# Altium schematic sheet RK3399PRO-JD4.SchDoc
size A2; SheetNumber: 7; SheetTotal: 16
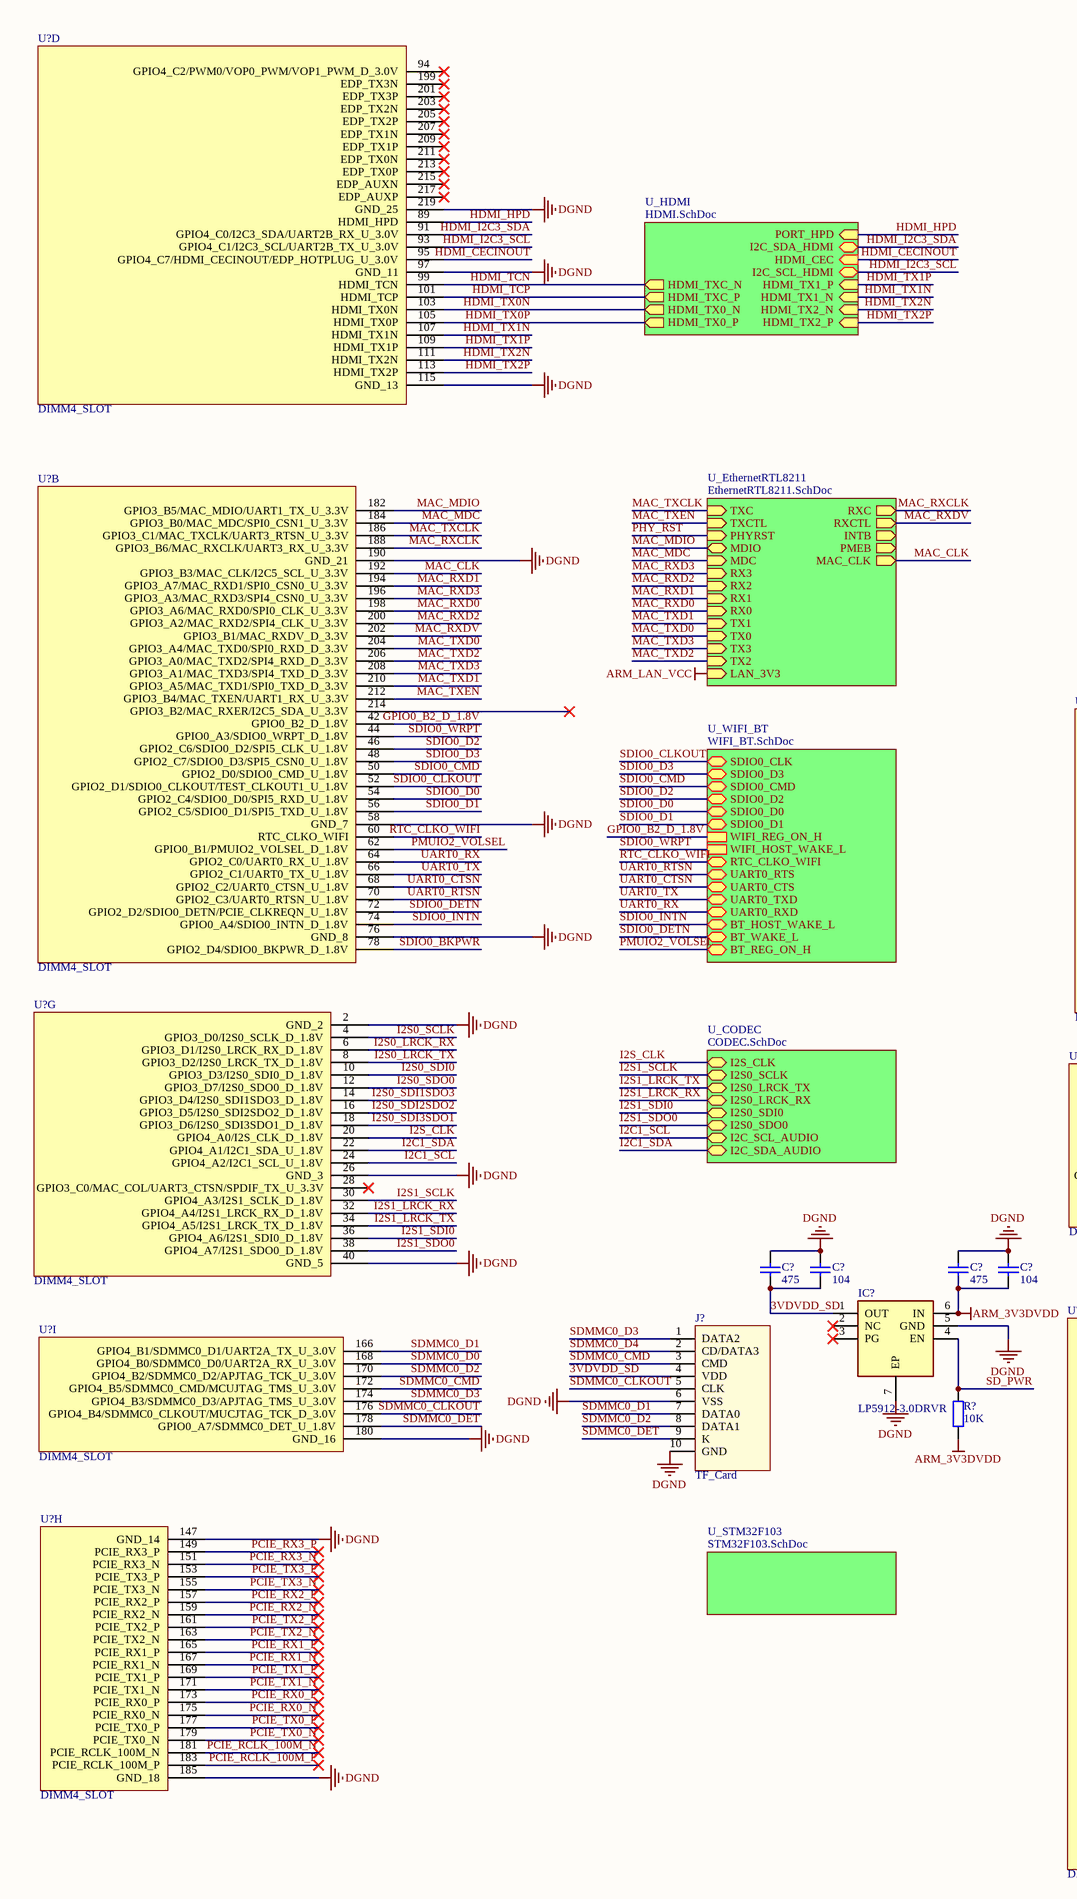
[diagram p0: RK3399PRO-JD4.SchDoc, left]
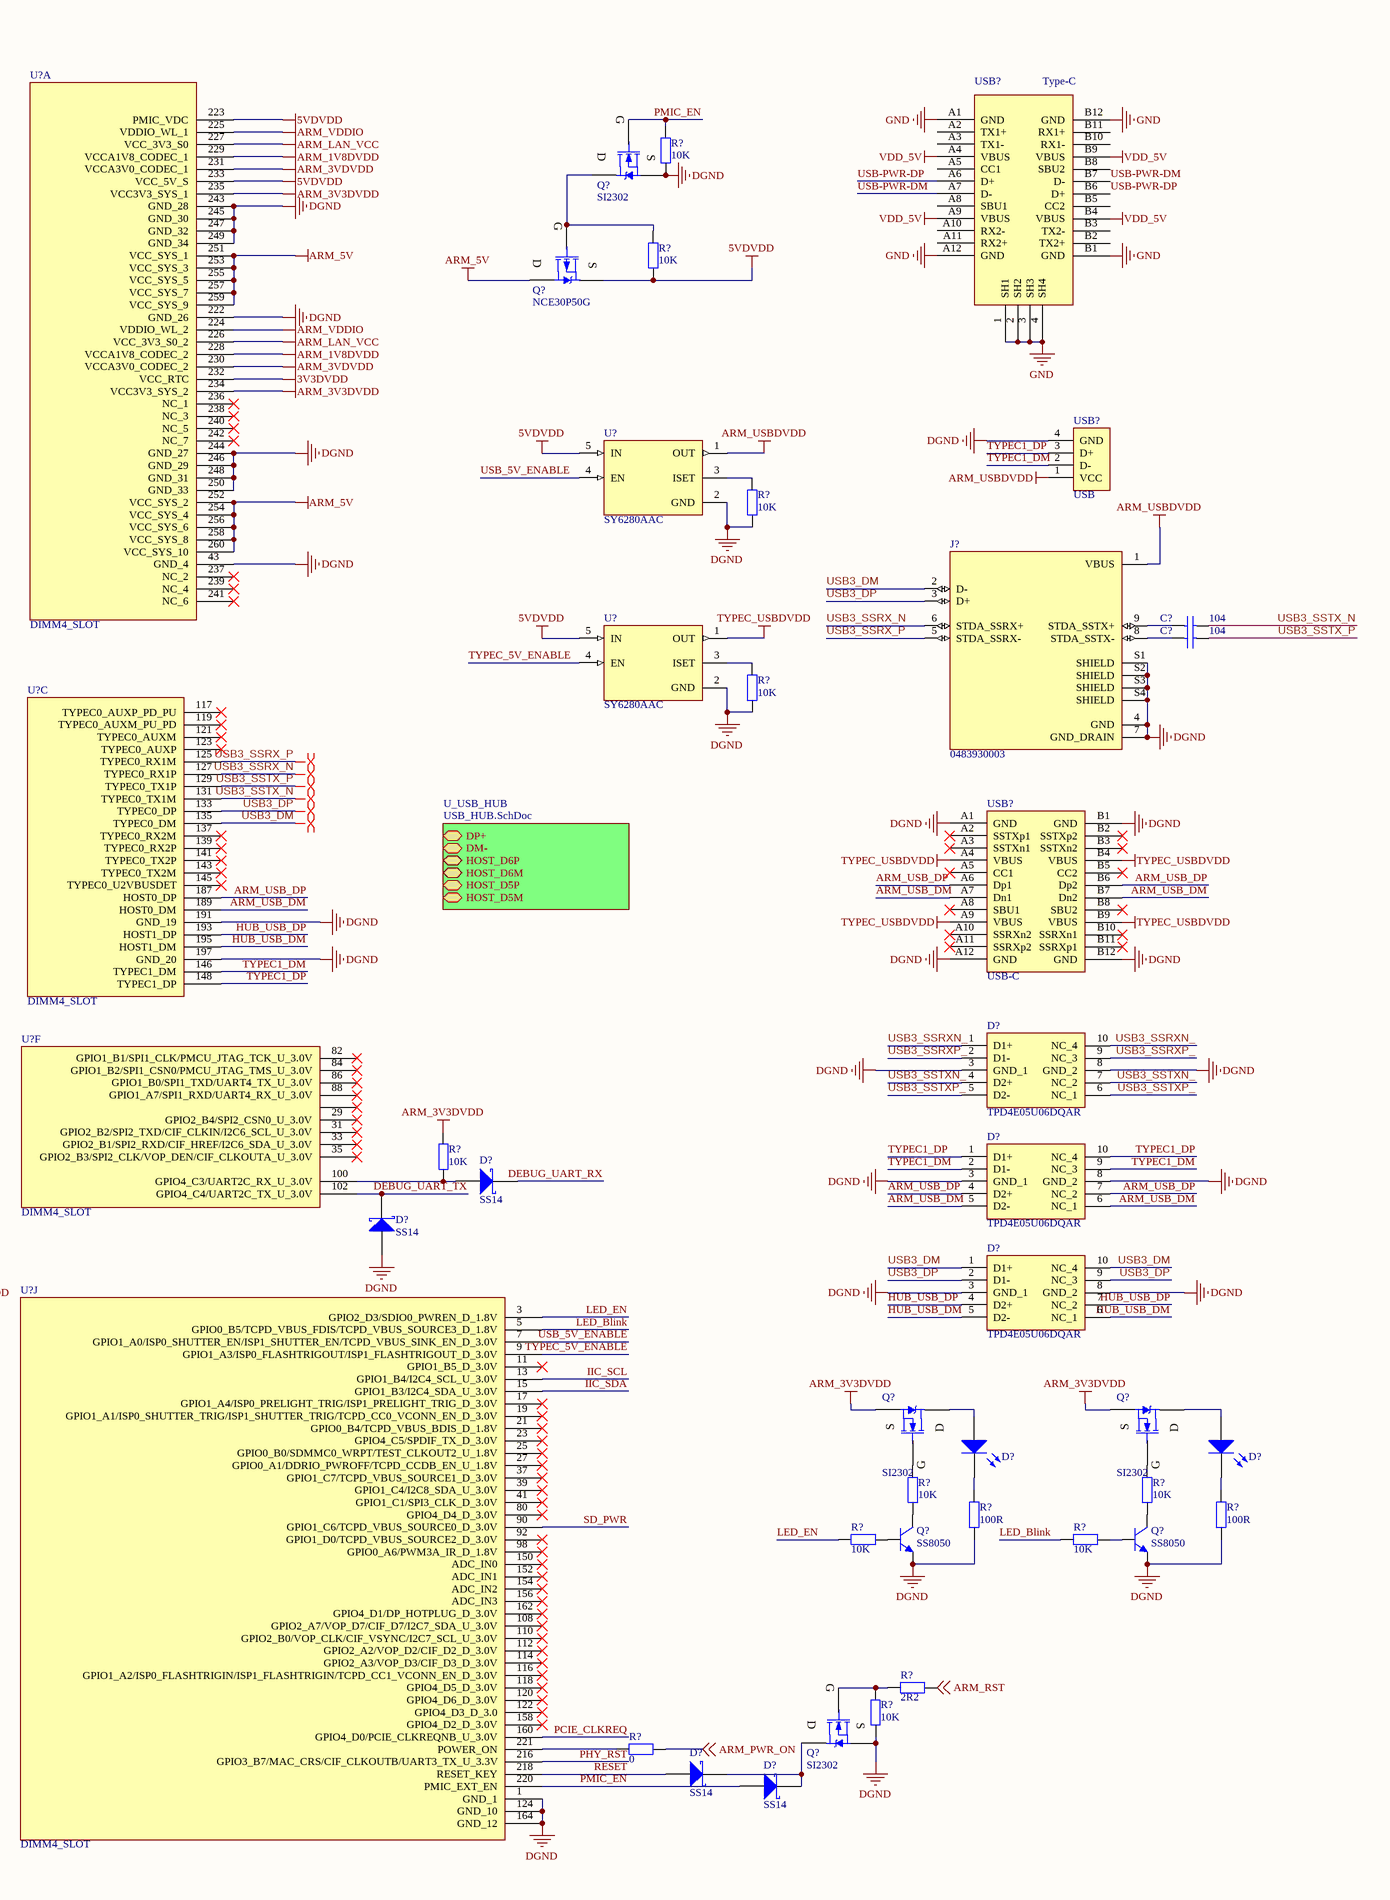
[diagram p1: RK3399PRO-JD4.SchDoc, right]

## Parts
(Parts that share a designator on the sheet are numbered #1, #2 ... from top to bottom, then left to right.)
C?#1  104  [C 0603_L]
C?#2  104  [C 0603_L]
C?#3  475  [C 0603_L]
C?#4  104  [C 0603_L]
C?#5  475  [C 0603_L]
C?#6  104  [C 0603_L]
D?#1  TPD4E05U06DQAR  [DQA(R-PUSON-N10)]
D?#2  TPD4E05U06DQAR  [DQA(R-PUSON-N10)]
D?#3  SS14  [SOD-323]
D?#4  SS14  [SOD-323]
D?#5  TPD4E05U06DQAR  [DQA(R-PUSON-N10)]
D?#6  LED  [LED_A1]  (value not drawn)
D?#7  LED  [LED_A1]  (value not drawn)
D?#8  SS14  [SOD-323]
D?#9  SS14  [SOD-323]
IC?  LP5912-3.0DRVR  [SON65P200X200X80-7N]
J?#1  0483930003  [MOLEX_0483930003]
J?#2  TF_Card  [Micro SD]
Q?#1  SI2302  [SOT23-3N]
Q?#2  NCE30P50G  [DFN 5X6]
Q?#3  SI2302  [SOT23-3N]
Q?#4  SI2302  [SOT23-3N]
Q?#5  SS8050  [SOT23-3N]
Q?#6  SS8050  [SOT23-3N]
Q?#7  SI2302  [SOT23-3N]
R?#1  10K  [R 0603_L]
R?#2  10K  [R 0603_L]
R?#3  10K  [R 0603_L]
R?#4  10K  [R 0603_L]
R?#5  10K  [R 0603_L]
R?#6  10K  [R 0603_L]
R?#7  10K  [R 0603_L]
R?#8  10K  [R 0603_L]
R?#9  100R  [R 0603_L]
R?#10  100R  [R 0603_L]
R?#11  10K  [R 0603_L]
R?#12  10K  [R 0603_L]
R?#13  2R2  [R 0603_L]
R?#14  10K  [R 0603_L]
R?#15  0  [R 0603_L]
U?#1  DIMM4_SLOT  (part D of 10)
U?#2  SY6280AAC  [SOT95P285X130-5N]
U?#3  DIMM4_SLOT  (part A of 10)
U?#4  SY6280AAC  [SOT95P285X130-5N]
U?#5  DIMM4_SLOT  (part B of 10)
U?#6  DIMM4_SLOT  (part C of 10)
U?#7  DIMM4_SLOT  (part F of 10)
U?#8  DIMM4_SLOT  (part G of 10)
U?#9  DIMM4_SLOT  (part I of 10)
U?#10  DIMM4_SLOT  (part H of 10)
U?#11  DIMM4_SLOT  (part J of 10)
USB?#1  Type-C  [Type-C-TOP]
USB?#2  USB  [USB_A/P_A]
USB?#3  USB-C  [USB-C/S_A]

## Sub-sheets
U_CODEC = CODEC.SchDoc: I2S_CLK (bidir), I2S0_SCLK (bidir), I2S0_LRCK_TX (bidir), I2S0_LRCK_RX (bidir), I2S0_SDI0 (bidir), I2S0_SDO0 (bidir), I2C_SCL_AUDIO (bidir), I2C_SDA_AUDIO (bidir)
U_EthernetRTL8211 = EthernetRTL8211.SchDoc: RXC (out), TXC (in), RXCTL (out), INTB (out), TXCTL (in), PHYRST (in), MDIO (bidir), MDC (in), PMEB (out), RX3 (in), RX2 (in), RX1 (in), RX0 (in), TX1 (in), TX0 (in), TX3 (in), TX2 (in), MAC_CLK (out), LAN_3V3 (in)
U_HDMI = HDMI.SchDoc: HDMI_TX2_P (in), HDMI_TX2_N (in), HDMI_TX1_N (in), HDMI_TX1_P (in), HDMI_TX0_P (out), HDMI_TX0_N (out), HDMI_TXC_P (out), HDMI_TXC_N (out), I2C_SCL_HDMI (bidir), HDMI_CEC (in), I2C_SDA_HDMI (bidir), PORT_HPD (in)
U_STM32F103 = STM32F103.SchDoc: no entries
U_USB_HUB = USB_HUB.SchDoc: DP+ (bidir), DM- (bidir), HOST_D6P (bidir), HOST_D6M (bidir), HOST_D5P (bidir), HOST_D5M (bidir)
U_WIFI_BT = WIFI_BT.SchDoc: SDIO0_CLK (bidir), SDIO0_D3 (bidir), SDIO0_CMD (bidir), SDIO0_D2 (bidir), SDIO0_D0 (bidir), SDIO0_D1 (bidir), WIFI_REG_ON_H, WIFI_HOST_WAKE_L, RTC_CLKO_WIFI (bidir), UART0_RTS (bidir), UART0_CTS (bidir), UART0_TXD (bidir), UART0_RXD (bidir), BT_HOST_WAKE_L (bidir), BT_WAKE_L (bidir), BT_REG_ON_H (bidir)

## Nets
3V3DVDD: U?#3.232(VCC_RTC)
5VDVDD: Q?#2.3(S) R?#2.1 U?#2.5(IN) U?#3.223(PMIC_VDC) U?#3.233(VCC_5V_S) U?#4.5(IN)
ARM_1V8DVDD: U?#3.228(VCCA1V8_CODEC_2) U?#3.229(VCCA1V8_CODEC_1)
ARM_3V3DVDD: C?#5.1 C?#6.1 IC?.6(IN) Q?#3.2(S) Q?#4.2(S) R?#5.2 R?#6.1 U?#3.234(VCC3V3_SYS_2) U?#3.235(VCC3V3_SYS_1)
ARM_3VDVDD: U?#3.230(VCCA3V0_CODEC_2) U?#3.231(VCCA3V0_CODEC_1)
ARM_5V: Q?#2.2(D) U?#3.251(VCC_SYS_1) U?#3.252(VCC_SYS_2) U?#3.253(VCC_SYS_3) U?#3.254(VCC_SYS_4) U?#3.255(VCC_SYS_5) U?#3.256(VCC_SYS_6) U?#3.257(VCC_SYS_7) U?#3.258(VCC_SYS_8) U?#3.259(VCC_SYS_9) U?#3.260(VCC_SYS_10)
ARM_LAN_VCC: U?#3.226(VCC_3V3_S0_2) U?#3.227(VCC_3V3_S0) ; sheet U_EthernetRTL8211/LAN_3V3
ARM_USBDVDD: J?#1.1(VBUS) U?#2.1(OUT) USB?#2.1(VCC)
ARM_VDDIO: U?#3.224(VDDIO_WL_2) U?#3.225(VDDIO_WL_1)
DGND: C?#3.2 C?#4.2 C?#5.2 C?#6.2 D?#1.3(GND_1) D?#1.8(GND_2) D?#2.3(GND_1) D?#2.8(GND_2) D?#4.1(A) D?#5.3(GND_1) D?#5.8(GND_2) IC?.5(GND) IC?.7(EP) J?#1.4(GND) J?#1.7(GND_DRAIN) J?#1.S1(SHIELD) J?#1.S2(SHIELD) J?#1.S3(SHIELD) J?#1.S4(SHIELD) J?#2.6(VSS) J?#2.10(GND) Q?#1.2(S) Q?#5.2(E) Q?#6.2(E) Q?#7.2(S) R?#1.1 R?#3.1 R?#4.1 R?#9.1 R?#10.1 R?#14.2 U?#1.97(GND_11) U?#1.115(GND_13) U?#1.219(GND_25) U?#2.2(GND) U?#3.43(GND_4) U?#3.222(GND_26) U?#3.243(GND_28) U?#3.244(GND_27) U?#3.245(GND_30) U?#3.246(GND_29) U?#3.247(GND_32) U?#3.248(GND_31) U?#3.249(GND_34) U?#3.250(GND_33) U?#4.2(GND) U?#5.58(GND_7) U?#5.76(GND_8) U?#5.190(GND_21) U?#6.191(GND_19) U?#6.197(GND_20) U?#8.2(GND_2) U?#8.26(GND_3) U?#8.40(GND_5) U?#9.180(GND_16) U?#10.147(GND_14) U?#10.185(GND_18) U?#11.1(GND_1) U?#11.124(GND_10) U?#11.164(GND_12) USB?#2.4(GND) USB?#3.A1(GND) USB?#3.A12(GND) USB?#3.B1(GND) USB?#3.B12(GND)
GND: USB?#1.1(SH1) USB?#1.2(SH2) USB?#1.3(SH3) USB?#1.4(SH4) USB?#1.A1(GND) USB?#1.A12(GND) USB?#1.B1(GND) USB?#1.B12(GND)
TYPEC_USBDVDD: U?#4.1(OUT) USB?#3.A4(VBUS) USB?#3.A9(VBUS) USB?#3.B4(VBUS) USB?#3.B9(VBUS)
VDD_5V: USB?#1.A4(VBUS) USB?#1.A9(VBUS) USB?#1.B4(VBUS) USB?#1.B9(VBUS)
3VDVDD_SD: C?#3.1 C?#4.1 IC?.1(OUT) J?#2.4(VDD)
ARM_PWR_ON: R?#15.1 ; off-sheet ARM_PWR_ON
ARM_RST: R?#13.1 ; off-sheet ARM_RST
ARM_USB_DM: D?#2.5(D2-) D?#2.6(NC_1) U?#6.189(HOST0_DM) USB?#3.A7(Dn1) USB?#3.B7(Dn2)
ARM_USB_DP: D?#2.4(D2+) D?#2.7(NC_2) U?#6.187(HOST0_DP) USB?#3.A6(Dp1) USB?#3.B6(Dp2)
DEBUG_UART_RX: D?#3.2(K)
DEBUG_UART_TX: D?#4.2(K) U?#7.102(GPIO4_C4/UART2C_TX_U_3.0V)
GPIO0_B2_D_1.8V: U?#5.42(GPIO0_B2_D_1.8V) ; sheet U_WIFI_BT/WIFI_REG_ON_H
HDMI_CECINOUT: U?#1.95(GPIO4_C7/HDMI_CECINOUT/EDP_HOTPLUG_U_3.0V) ; sheet U_HDMI/HDMI_CEC
HDMI_HPD: U?#1.89(HDMI_HPD) ; sheet U_HDMI/PORT_HPD
HDMI_I2C3_SCL: U?#1.93(GPIO4_C1/I2C3_SCL/UART2B_TX_U_3.0V) ; sheet U_HDMI/I2C_SCL_HDMI
HDMI_I2C3_SDA: U?#1.91(GPIO4_C0/I2C3_SDA/UART2B_RX_U_3.0V) ; sheet U_HDMI/I2C_SDA_HDMI
HDMI_TCN: U?#1.99(HDMI_TCN) ; sheet U_HDMI/HDMI_TXC_N
HDMI_TCP: U?#1.101(HDMI_TCP) ; sheet U_HDMI/HDMI_TXC_P
HDMI_TX0N: U?#1.103(HDMI_TX0N) ; sheet U_HDMI/HDMI_TX0_N
HDMI_TX0P: U?#1.105(HDMI_TX0P) ; sheet U_HDMI/HDMI_TX0_P
HDMI_TX1N: U?#1.107(HDMI_TX1N) ; sheet U_HDMI/HDMI_TX1_N
HDMI_TX1P: U?#1.109(HDMI_TX1P) ; sheet U_HDMI/HDMI_TX1_P
HDMI_TX2N: U?#1.111(HDMI_TX2N) ; sheet U_HDMI/HDMI_TX2_N
HDMI_TX2P: U?#1.113(HDMI_TX2P) ; sheet U_HDMI/HDMI_TX2_P
HUB_USB_DM: D?#5.5(D2-) D?#5.6(NC_1) U?#6.195(HOST1_DM)
HUB_USB_DP: D?#5.4(D2+) D?#5.7(NC_2) U?#6.193(HOST1_DP)
I2C1_SCL: U?#8.24(GPIO4_A2/I2C1_SCL_U_1.8V) ; sheet U_CODEC/I2C_SCL_AUDIO
I2C1_SDA: U?#8.22(GPIO4_A1/I2C1_SDA_U_1.8V) ; sheet U_CODEC/I2C_SDA_AUDIO
I2S0_LRCK_RX: U?#8.6(GPIO3_D1/I2S0_LRCK_RX_D_1.8V)
I2S0_LRCK_TX: U?#8.8(GPIO3_D2/I2S0_LRCK_TX_D_1.8V)
I2S0_SCLK: U?#8.4(GPIO3_D0/I2S0_SCLK_D_1.8V)
I2S0_SDI0: U?#8.10(GPIO3_D3/I2S0_SDI0_D_1.8V)
I2S0_SDI1SDO3: U?#8.14(GPIO3_D4/I2S0_SDI1SDO3_D_1.8V)
I2S0_SDI2SDO2: U?#8.16(GPIO3_D5/I2S0_SDI2SDO2_D_1.8V)
I2S0_SDI3SDO1: U?#8.18(GPIO3_D6/I2S0_SDI3SDO1_D_1.8V)
I2S0_SDO0: U?#8.12(GPIO3_D7/I2S0_SDO0_D_1.8V)
I2S1_LRCK_RX: U?#8.32(GPIO4_A4/I2S1_LRCK_RX_D_1.8V) ; sheet U_CODEC/I2S0_LRCK_RX
I2S1_LRCK_TX: U?#8.34(GPIO4_A5/I2S1_LRCK_TX_D_1.8V) ; sheet U_CODEC/I2S0_LRCK_TX
I2S1_SCLK: U?#8.30(GPIO4_A3/I2S1_SCLK_D_1.8V) ; sheet U_CODEC/I2S0_SCLK
I2S1_SDI0: U?#8.36(GPIO4_A6/I2S1_SDI0_D_1.8V) ; sheet U_CODEC/I2S0_SDI0
I2S1_SDO0: U?#8.38(GPIO4_A7/I2S1_SDO0_D_1.8V) ; sheet U_CODEC/I2S0_SDO0
I2S_CLK: U?#8.20(GPIO4_A0/I2S_CLK_D_1.8V) ; sheet U_CODEC/I2S_CLK
IIC_SCL: U?#11.13(GPIO1_B4/I2C4_SCL_U_3.0V)
IIC_SDA: U?#11.15(GPIO1_B3/I2C4_SDA_U_3.0V)
LED_Blink: R?#12.1 U?#11.5(GPIO0_B5/TCPD_VBUS_FDIS/TCPD_VBUS_SOURCE3_D_1.8V)
LED_EN: R?#11.1 U?#11.3(GPIO2_D3/SDIO0_PWREN_D_1.8V)
MAC_CLK: U?#5.192(GPIO3_B3/MAC_CLK/I2C5_SCL_U_3.3V) ; sheet U_EthernetRTL8211/MAC_CLK
MAC_MDC: U?#5.184(GPIO3_B0/MAC_MDC/SPI0_CSN1_U_3.3V) ; sheet U_EthernetRTL8211/MDC
MAC_MDIO: U?#5.182(GPIO3_B5/MAC_MDIO/UART1_TX_U_3.3V) ; sheet U_EthernetRTL8211/MDIO
MAC_RXCLK: U?#5.188(GPIO3_B6/MAC_RXCLK/UART3_RX_U_3.3V) ; sheet U_EthernetRTL8211/RXC
MAC_RXD0: U?#5.198(GPIO3_A6/MAC_RXD0/SPI0_CLK_U_3.3V) ; sheet U_EthernetRTL8211/RX0
MAC_RXD1: U?#5.194(GPIO3_A7/MAC_RXD1/SPI0_CSN0_U_3.3V) ; sheet U_EthernetRTL8211/RX1
MAC_RXD2: U?#5.200(GPIO3_A2/MAC_RXD2/SPI4_CLK_U_3.3V) ; sheet U_EthernetRTL8211/RX2
MAC_RXD3: U?#5.196(GPIO3_A3/MAC_RXD3/SPI4_CSN0_U_3.3V) ; sheet U_EthernetRTL8211/RX3
MAC_RXDV: U?#5.202(GPIO3_B1/MAC_RXDV_D_3.3V) ; sheet U_EthernetRTL8211/RXCTL
MAC_TXCLK: U?#5.186(GPIO3_C1/MAC_TXCLK/UART3_RTSN_U_3.3V) ; sheet U_EthernetRTL8211/TXC
MAC_TXD0: U?#5.204(GPIO3_A4/MAC_TXD0/SPI0_RXD_D_3.3V) ; sheet U_EthernetRTL8211/TX0
MAC_TXD1: U?#5.210(GPIO3_A5/MAC_TXD1/SPI0_TXD_D_3.3V) ; sheet U_EthernetRTL8211/TX1
MAC_TXD2: U?#5.206(GPIO3_A0/MAC_TXD2/SPI4_RXD_D_3.3V) ; sheet U_EthernetRTL8211/TX2
MAC_TXD3: U?#5.208(GPIO3_A1/MAC_TXD3/SPI4_TXD_D_3.3V) ; sheet U_EthernetRTL8211/TX3
MAC_TXEN: U?#5.212(GPIO3_B4/MAC_TXEN/UART1_RX_U_3.3V) ; sheet U_EthernetRTL8211/TXCTL
PCIE_CLKREQ: U?#11.160(GPIO4_D0/PCIE_CLKREQNB_U_3.0V)
PCIE_RCLK_100M_N: U?#10.181(PCIE_RCLK_100M_N)
PCIE_RCLK_100M_P: U?#10.183(PCIE_RCLK_100M_P)
PCIE_RX0_N: U?#10.175(PCIE_RX0_N)
PCIE_RX0_P: U?#10.173(PCIE_RX0_P)
PCIE_RX1_N: U?#10.167(PCIE_RX1_N)
PCIE_RX1_P: U?#10.165(PCIE_RX1_P)
PCIE_RX2_N: U?#10.159(PCIE_RX2_N)
PCIE_RX2_P: U?#10.157(PCIE_RX2_P)
PCIE_RX3_N: U?#10.151(PCIE_RX3_N)
PCIE_RX3_P: U?#10.149(PCIE_RX3_P)
PCIE_TX0_N: U?#10.179(PCIE_TX0_N)
PCIE_TX0_P: U?#10.177(PCIE_TX0_P)
PCIE_TX1_N: U?#10.171(PCIE_TX1_N)
PCIE_TX1_P: U?#10.169(PCIE_TX1_P)
PCIE_TX2_N: U?#10.163(PCIE_TX2_N)
PCIE_TX2_P: U?#10.161(PCIE_TX2_P)
PCIE_TX3_N: U?#10.155(PCIE_TX3_N)
PCIE_TX3_P: U?#10.153(PCIE_TX3_P)
PHY_RST: U?#11.216(GPIO3_B7/MAC_CRS/CIF_CLKOUTB/UART3_TX_U_3.3V) ; sheet U_EthernetRTL8211/PHYRST
PMIC_EN: D?#9.1(A) Q?#1.1(G) R?#1.2 U?#11.220(PMIC_EXT_EN)
PMUIO2_VOLSEL: U?#5.62(GPIO0_B1/PMUIO2_VOLSEL_D_1.8V) ; sheet U_WIFI_BT/BT_REG_ON_H
RESET: D?#8.1(A) U?#11.218(RESET_KEY)
RTC_CLKO_WIFI: U?#5.60(RTC_CLKO_WIFI) ; sheet U_WIFI_BT/RTC_CLKO_WIFI
SD_PWR: IC?.4(EN) R?#6.2 U?#11.90(GPIO1_C6/TCPD_VBUS_SOURCE0_D_3.0V)
SDIO0_BKPWR: U?#5.78(GPIO2_D4/SDIO0_BKPWR_D_1.8V)
SDIO0_CLKOUT: U?#5.52(GPIO2_D1/SDIO0_CLKOUT/TEST_CLKOUT1_U_1.8V) ; sheet U_WIFI_BT/SDIO0_CLK
SDIO0_CMD: U?#5.50(GPIO2_D0/SDIO0_CMD_U_1.8V) ; sheet U_WIFI_BT/SDIO0_CMD
SDIO0_D0: U?#5.54(GPIO2_C4/SDIO0_D0/SPI5_RXD_U_1.8V) ; sheet U_WIFI_BT/SDIO0_D0
SDIO0_D1: U?#5.56(GPIO2_C5/SDIO0_D1/SPI5_TXD_U_1.8V) ; sheet U_WIFI_BT/SDIO0_D1
SDIO0_D2: U?#5.46(GPIO2_C6/SDIO0_D2/SPI5_CLK_U_1.8V) ; sheet U_WIFI_BT/SDIO0_D2
SDIO0_D3: U?#5.48(GPIO2_C7/SDIO0_D3/SPI5_CSN0_U_1.8V) ; sheet U_WIFI_BT/SDIO0_D3
SDIO0_DETN: U?#5.72(GPIO2_D2/SDIO0_DETN/PCIE_CLKREQN_U_1.8V) ; sheet U_WIFI_BT/BT_WAKE_L
SDIO0_INTN: U?#5.74(GPIO0_A4/SDIO0_INTN_D_1.8V) ; sheet U_WIFI_BT/BT_HOST_WAKE_L
SDIO0_WRPT: U?#5.44(GPIO0_A3/SDIO0_WRPT_D_1.8V) ; sheet U_WIFI_BT/WIFI_HOST_WAKE_L
SDMMC0_CLKOUT: J?#2.5(CLK) U?#9.176(GPIO4_B4/SDMMC0_CLKOUT/MUCJTAG_TCK_D_3.0V)
SDMMC0_CMD: J?#2.3(CMD) U?#9.172(GPIO4_B5/SDMMC0_CMD/MCUJTAG_TMS_U_3.0V)
SDMMC0_D0: U?#9.168(GPIO4_B0/SDMMC0_D0/UART2A_RX_U_3.0V)
SDMMC0_D1: J?#2.7(DATA0) U?#9.166(GPIO4_B1/SDMMC0_D1/UART2A_TX_U_3.0V)
SDMMC0_D2: J?#2.8(DATA1) U?#9.170(GPIO4_B2/SDMMC0_D2/APJTAG_TCK_U_3.0V)
SDMMC0_D3: J?#2.1(DATA2) U?#9.174(GPIO4_B3/SDMMC0_D3/APJTAG_TMS_U_3.0V)
SDMMC0_D4: J?#2.2(CD/DATA3)
SDMMC0_DET: J?#2.9(K) U?#9.178(GPIO0_A7/SDMMC0_DET_U_1.8V)
TYPEC1_DM: D?#2.2(D1-) D?#2.9(NC_3) U?#6.146(TYPEC1_DM) USB?#2.2(D-)
TYPEC1_DP: D?#2.1(D1+) D?#2.10(NC_4) U?#6.148(TYPEC1_DP) USB?#2.3(D+)
TYPEC_5V_ENABLE: U?#4.4(EN) U?#11.9(GPIO1_A3/ISP0_FLASHTRIGOUT/ISP1_FLASHTRIGOUT_D_3.0V)
UART0_CTSN: U?#5.68(GPIO2_C2/UART0_CTSN_U_1.8V) ; sheet U_WIFI_BT/UART0_CTS
UART0_RTSN: U?#5.70(GPIO2_C3/UART0_RTSN_U_1.8V) ; sheet U_WIFI_BT/UART0_RTS
UART0_RX: U?#5.64(GPIO2_C0/UART0_RX_U_1.8V) ; sheet U_WIFI_BT/UART0_RXD
UART0_TX: U?#5.66(GPIO2_C1/UART0_TX_U_1.8V) ; sheet U_WIFI_BT/UART0_TXD
USB3_DM: D?#5.1(D1+) D?#5.10(NC_4) J?#1.2(D-) U?#6.135(TYPEC0_DM)
USB3_DP: D?#5.2(D1-) D?#5.9(NC_3) J?#1.3(D+) U?#6.133(TYPEC0_DP)
USB3_SSRX_N: J?#1.6(STDA_SSRX+) U?#6.127(TYPEC0_RX1P)
USB3_SSRX_P: J?#1.5(STDA_SSRX-) U?#6.125(TYPEC0_RX1M)
USB3_SSRXN_: D?#1.1(D1+) D?#1.10(NC_4)
USB3_SSRXP_: D?#1.2(D1-) D?#1.9(NC_3)
USB3_SSTX_N: C?#1.1 U?#6.131(TYPEC0_TX1M)
USB3_SSTX_P: C?#2.1 U?#6.129(TYPEC0_TX1P)
USB3_SSTXN_: D?#1.4(D2+) D?#1.7(NC_2)
USB3_SSTXP_: D?#1.5(D2-) D?#1.6(NC_1)
USB-PWR-DM: USB?#1.A7(D-) USB?#1.B7(D-)
USB-PWR-DP: USB?#1.A6(D+) USB?#1.B6(D+)
USB_5V_ENABLE: U?#2.4(EN) U?#11.7(GPIO1_A0/ISP0_SHUTTER_EN/ISP1_SHUTTER_EN/TCPD_VBUS_SINK_EN_D_3.0V)
NetC?#1_2: C?#1.2 J?#1.9(STDA_SSTX+)
NetC?#2_2: C?#2.2 J?#1.8(STDA_SSTX-)
NetD?#3_1: D?#3.1(A) R?#5.1 U?#7.100(GPIO4_C3/UART2C_RX_U_3.0V)
NetD?#6_1: D?#6.1(A) Q?#3.3(D)
NetD?#6_2: D?#6.2(K) R?#9.2
NetD?#7_1: D?#7.1(A) Q?#4.3(D)
NetD?#7_2: D?#7.2(K) R?#10.2
NetD?#8_2: D?#8.2(K) D?#9.2(K) Q?#7.3(D)
NetQ?#1_3: Q?#1.3(D) Q?#2.1(G) R?#2.2
NetQ?#3_1: Q?#3.1(G) R?#7.2
NetQ?#4_1: Q?#4.1(G) R?#8.1
NetQ?#5_1: Q?#5.1(B) R?#11.2
NetQ?#5_3: Q?#5.3(C) R?#7.1
NetQ?#6_1: Q?#6.1(B) R?#12.2
NetQ?#6_3: Q?#6.3(C) R?#8.2
NetQ?#7_1: Q?#7.1(G) R?#13.2 R?#14.1
NetR?#3_2: R?#3.2 U?#2.3(ISET)
NetR?#4_2: R?#4.2 U?#4.3(ISET)
NetR?#15_2: R?#15.2 U?#11.221(POWER_ON)

Not connected (* = marked no-connect by the designer): IC? 2(NC)* 3(PG)*; U?#1 94(GPIO4_C2/PWM0/VOP0_PWM/VOP1_PWM_D_3.0V)* 199(EDP_TX3N)* 201(EDP_TX3P)* 203(EDP_TX2N)* 205(EDP_TX2P)* 207(EDP_TX1N)* 209(EDP_TX1P)* 211(EDP_TX0N)* 213(EDP_TX0P)* 215(EDP_AUXN)* 217(EDP_AUXP)*; U?#3 236(NC_1)* 237(NC_2)* 238(NC_3)* 239(NC_4)* 240(NC_5)* 241(NC_6)* 242(NC_7)*; U?#5 214(GPIO3_B2/MAC_RXER/I2C5_SDA_U_3.3V)*; U?#6 117(TYPEC0_AUXP_PD_PU)* 119(TYPEC0_AUXM_PU_PD)* 121(TYPEC0_AUXM)* 123(TYPEC0_AUXP)* 137(TYPEC0_RX2M)* 139(TYPEC0_RX2P)* 141(TYPEC0_TX2P)* 143(TYPEC0_TX2M)* 145(TYPEC0_U2VBUSDET)*; U?#7 29(GPIO2_B4/SPI2_CSN0_U_3.0V)* 31(GPIO2_B2/SPI2_TXD/CIF_CLKIN/I2C6_SCL_U_3.0V)* 33(GPIO2_B1/SPI2_RXD/CIF_HREF/I2C6_SDA_U_3.0V)* 35(GPIO2_B3/SPI2_CLK/VOP_DEN/CIF_CLKOUTA_U_3.0V)* 82(GPIO1_B1/SPI1_CLK/PMCU_JTAG_TCK_U_3.0V)* 84(GPIO1_B2/SPI1_CSN0/PMCU_JTAG_TMS_U_3.0V)* 86(GPIO1_B0/SPI1_TXD/UART4_TX_U_3.0V)* 88(GPIO1_A7/SPI1_RXD/UART4_RX_U_3.0V)* ?1*; U?#8 28(GPIO3_C0/MAC_COL/UART3_CTSN/SPDIF_TX_U_3.3V)*; U?#11 11(GPIO1_B5_D_3.0V)* 17(GPIO1_A4/ISP0_PRELIGHT_TRIG/ISP1_PRELIGHT_TRIG_D_3.0V)* 19(GPIO1_A1/ISP0_SHUTTER_TRIG/ISP1_SHUTTER_TRIG/TCPD_CC0_VCONN_EN_D_3.0V)* 21(GPIO0_B4/TCPD_VBUS_BDIS_D_1.8V)* 23(GPIO4_C5/SPDIF_TX_D_3.0V)* 25(GPIO0_B0/SDMMC0_WRPT/TEST_CLKOUT2_U_1.8V)* 27(GPIO0_A1/DDRIO_PWROFF/TCPD_CCDB_EN_U_1.8V)* 37(GPIO1_C7/TCPD_VBUS_SOURCE1_D_3.0V)* 39(GPIO1_C4/I2C8_SDA_U_3.0V)* 41(GPIO1_C1/SPI3_CLK_D_3.0V)* 80(GPIO4_D4_D_3.0V)* 92(GPIO1_D0/TCPD_VBUS_SOURCE2_D_3.0V)* 98(GPIO0_A6/PWM3A_IR_D_1.8V)* 108(GPIO2_A7/VOP_D7/CIF_D7/I2C7_SDA_U_3.0V)* 110(GPIO2_B0/VOP_CLK/CIF_VSYNC/I2C7_SCL_U_3.0V)* 112(GPIO2_A2/VOP_D2/CIF_D2_D_3.0V)* 114(GPIO2_A3/VOP_D3/CIF_D3_D_3.0V)* 116(GPIO1_A2/ISP0_FLASHTRIGIN/ISP1_FLASHTRIGIN/TCPD_CC1_VCONN_EN_D_3.0V)* 118(GPIO4_D5_D_3.0V)* 120(GPIO4_D6_D_3.0V)* 122(GPIO4_D3_D_3.0)* 150(ADC_IN0)* 152(ADC_IN1)* 154(ADC_IN2)* 156(ADC_IN3)* 158(GPIO4_D2_D_3.0V)* 162(GPIO4_D1/DP_HOTPLUG_D_3.0V)*; USB?#1 A2(TX1+) A3(TX1-) A5(CC1) A8(SBU1) A10(RX2-) A11(RX2+) B2(TX2+) B3(TX2-) B5(CC2) B8(SBU2) B10(RX1-) B11(RX1+); USB?#3 A2(SSTXp1)* A3(SSTXn1)* A5(CC1)* A8(SBU1)* A10(SSRXn2)* A11(SSRXp2)* B2(SSTXp2)* B3(SSTXn2)* B5(CC2)* B8(SBU2)* B10(SSRXn1)* B11(SSRXp1)*

## Layout directives
differential pair: USB3_DM, USB3_DP, USB3_SSRX_N, USB3_SSRX_P, USB3_SSTX_N, USB3_SSTX_P

## Library data of the parts
C?#1-C?#6 = Cap: Capacitor; Published: 8-Jun-2000; LatestRevisionDate: 17-Jul-2002; LatestRevisionNote: Re-released for DXP Platform.; PackageReference: RAD-0.3; Publisher: Altium Limited
  C?#1 C?#2 C?#4 C?#6: Value: 104
  C?#3 C?#5: Value: 475
D?#1 D?#2 D?#5 = TPD4E05U06DQAR: Diode; Manufacturer_Name: Texas Instruments; Datasheet Link: http://www.ti.com/lit/gpn/tpd4e05u06; Manufacturer_Part_Number: TPD4E05U06DQAR; Mouser Part Number: 595-TPD4E05U06DQAR; Mouser Price/Stock: https://www.mouser.co.uk/ProductDetail/Texas-Instruments/TPD4E05U06DQAR?qs=%2FCrDlo5IrVPi4woOvWz0qA%3D%3D; Arrow Part Number: TPD4E05U06DQAR; Arrow Price/Stock: https://www.arrow.com/en/products/tpd4e05u06dqar/texas-instruments?region=nac
D?#3 D?#4 D?#8 D?#9 = SS14: 肖特基二极管; 属性: 40V/1A; BOM名称: 肖特基二极管; 封装库来自淘宝 ID：黄晶宝石: https://shop463601444.taobao.com
D?#6 D?#7 = LED: 发光二极管; 技术支持，联系售后: https://shop463601444.taobao.com
IC? = LP5912-3.0DRVR: Integrated Circuit; Manufacturer_Name: Texas Instruments; Datasheet Link: http://www.ti.com/lit/gpn/lp5912; Height: 0.8mm; Manufacturer_Part_Number: LP5912-3.0DRVR; Mouser Part Number: 595-LP5912-3.0DRVR; Mouser Price/Stock: https://www.mouser.co.uk/ProductDetail/Texas-Instruments/LP5912-3.0DRVR?qs=yBt6ao%2FxsTzuXuKE9NcTCg%3D%3D; Arrow Part Number: LP5912-3.0DRVR; Arrow Price/Stock: https://www.arrow.com/en/products/lp5912-3.0drvr/texas-instruments
J?#1 = 0483930003: Usb Rec 4p Ra Type a 15au; MF: {'manufacturer': u'Molex'}; Package: None; Price: None; Value: *; MP: 0483930003; Availability: Unavailable
J?#2 = TF_Card: TF卡座; BOM名称: TF卡座; 学习资源: https://shop463601444.taobao.com
Q?#1 Q?#3 Q?#4 Q?#7 = SI2302: N沟道场效应管; 技术支持，联系售后: 封装库来自淘宝 ID：黄晶宝石; BOM名称: N沟道场效应管; 学习资源: https://shop463601444.taobao.com
Q?#2 = IRF4905: P沟场效应管; BOM名称: P沟场效应管
Q?#5 Q?#6 = 8050-SMD: 高频放大-NPN型; 版权归属: 封装库来自淘宝 ID：黄晶宝石; 属性: 40V 1.5A 1W 100MHZ; BOM名称: 高频放大-NPN型; 联系售后: https://shop463601444.taobao.com
R?#1-R?#15 = 0805 电阻: 贴片电阻 0805 电阻; ComponentLink1Description: 供应商链接; ComponentLink1URL: http://www.szlcsc.com/product/details_18165.html; Package: 0805; Supplier: LC; SuppliersPartNumber: C17477
U?#1 U?#3 U?#5-U?#11 = RK3399-JD4-DDR4
U?#2 U?#4 = SY6280AAC: MF: {'manufacturer': u'Silergy'}; Package: None; Price: None; Value: *; MP: SY6280AAC; Availability: Unavailable
USB?#1 = USB-Type-C-TOP
USB?#2 = USB-A/P: USB-A型公接口; 版权归属: 封装库来自淘宝卖家 ID：黄晶宝石; BOM名称: USB-A型公接口; 学习资源: https://shop463601444.taobao.com
USB?#3 = USB-C/S: USB-C型母接口; 学习资源: 封装库来自淘宝卖家 ID：黄晶宝石; BOM名称: USB-C型母接口; 封装库来自淘宝 ID：黄晶宝石: https://shop463601444.taobao.com